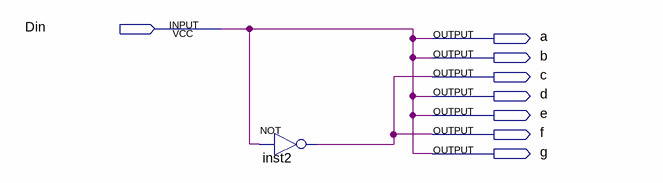
[diagram p0: schematic sheet]
// Quartus schematic render_tapeSymbol_2.bdf as structural Verilog: 1 symbols, 8 pins
module render_tapeSymbol_2 (
  input  Din,
  output a,
  output b,
  output c,
  output d,
  output e,
  output f,
  output g
);

  not inst2 (c, Din);

  assign a = Din;
  assign b = Din;
  assign d = Din;
  assign e = Din;
  assign f = c;
  assign g = Din;
endmodule
